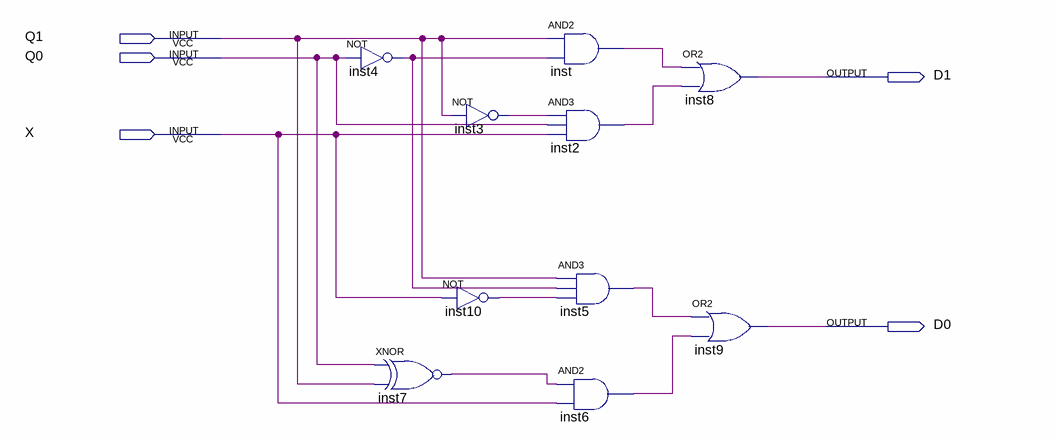
[diagram p0: schematic sheet]
// Quartus schematic SeqDet1101.bdf as structural Verilog: 10 symbols, 5 pins
module SeqDet1101 (
  input  Q1,
  input  Q0,
  input  X,
  output D1,
  output D0
);

  wire inst2_out, inst3_out, inst4_out, inst5_out, inst6_out, inst7_out, inst10_out, inst_out;

  not inst4 (inst4_out, Q0);
  xnor inst7 (inst7_out, Q0, Q1);
  not inst3 (inst3_out, Q1);
  not inst10 (inst10_out, X);
  and inst (inst_out, Q1, inst4_out);
  and inst2 (inst2_out, inst3_out, Q0, X);
  and inst5 (inst5_out, Q1, inst4_out, inst10_out);
  and inst6 (inst6_out, inst7_out, X);
  or inst8 (D1, inst_out, inst2_out);
  or inst9 (D0, inst5_out, inst6_out);
endmodule
